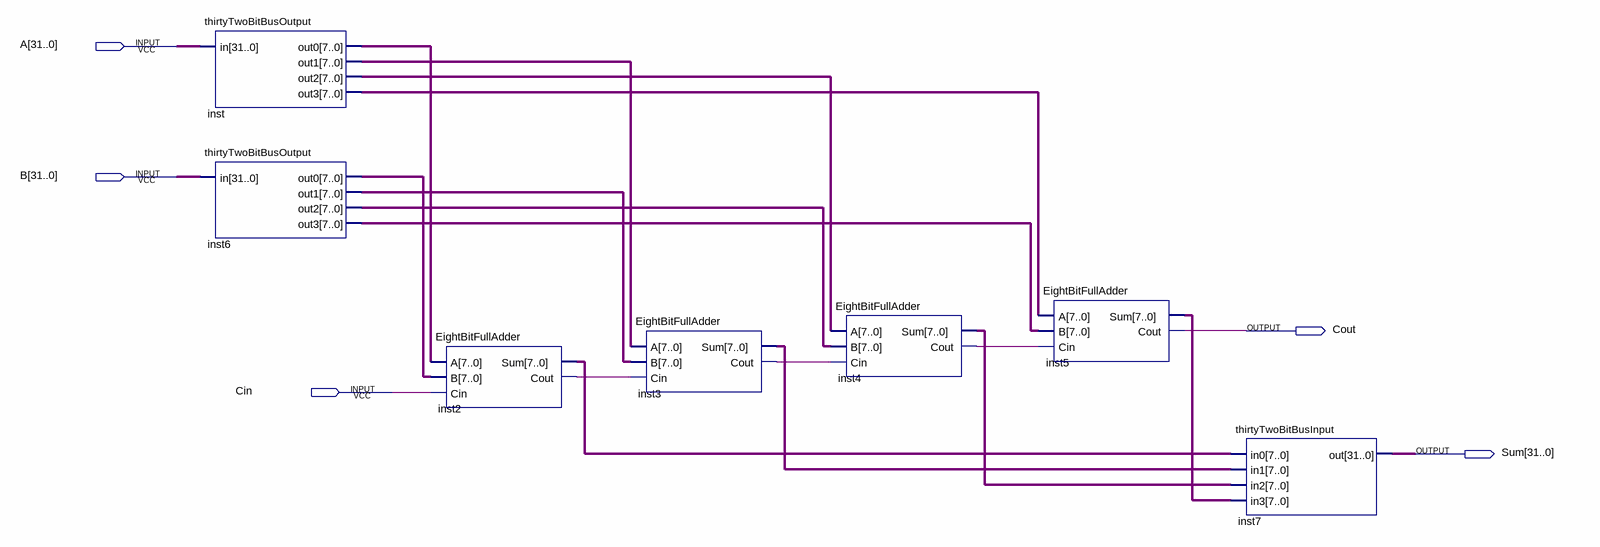
[diagram p0: schematic sheet]
// Quartus schematic ThiryTwoBitFullAdder.bdf as structural Verilog: 7 symbols, 5 pins
module ThiryTwoBitFullAdder (
  input  [31:0] A,
  input  [31:0] B,
  input  Cin,
  output Cout,
  output [31:0] Sum
);

  wire inst2_cout, inst3_cout, inst4_cout;
  wire [7:0] inst2_sum, inst3_sum, inst4_sum, inst5_sum, inst6_out0, inst6_out1, inst6_out2, inst6_out3,
       inst_out0, inst_out1, inst_out2, inst_out3;

  thirtyTwoBitBusOutput inst (.in(A), .out0(inst_out0), .out1(inst_out1), .out2(inst_out2), .out3(inst_out3));
  thirtyTwoBitBusOutput inst6 (.in(B), .out0(inst6_out0), .out1(inst6_out1), .out2(inst6_out2), .out3(inst6_out3));
  EightBitFullAdder inst2 (.A(inst_out0), .B(inst6_out0), .Cin(Cin), .Sum(inst2_sum), .Cout(inst2_cout));
  EightBitFullAdder inst3 (.A(inst_out1), .B(inst6_out1), .Cin(inst2_cout), .Sum(inst3_sum), .Cout(inst3_cout));
  EightBitFullAdder inst4 (.A(inst_out2), .B(inst6_out2), .Cin(inst3_cout), .Sum(inst4_sum), .Cout(inst4_cout));
  EightBitFullAdder inst5 (.A(inst_out3), .B(inst6_out3), .Cin(inst4_cout), .Sum(inst5_sum), .Cout(Cout));
  thirtyTwoBitBusInput inst7 (.in0(inst2_sum), .in1(inst3_sum), .in2(inst4_sum), .in3(inst5_sum), .out(Sum));
endmodule
